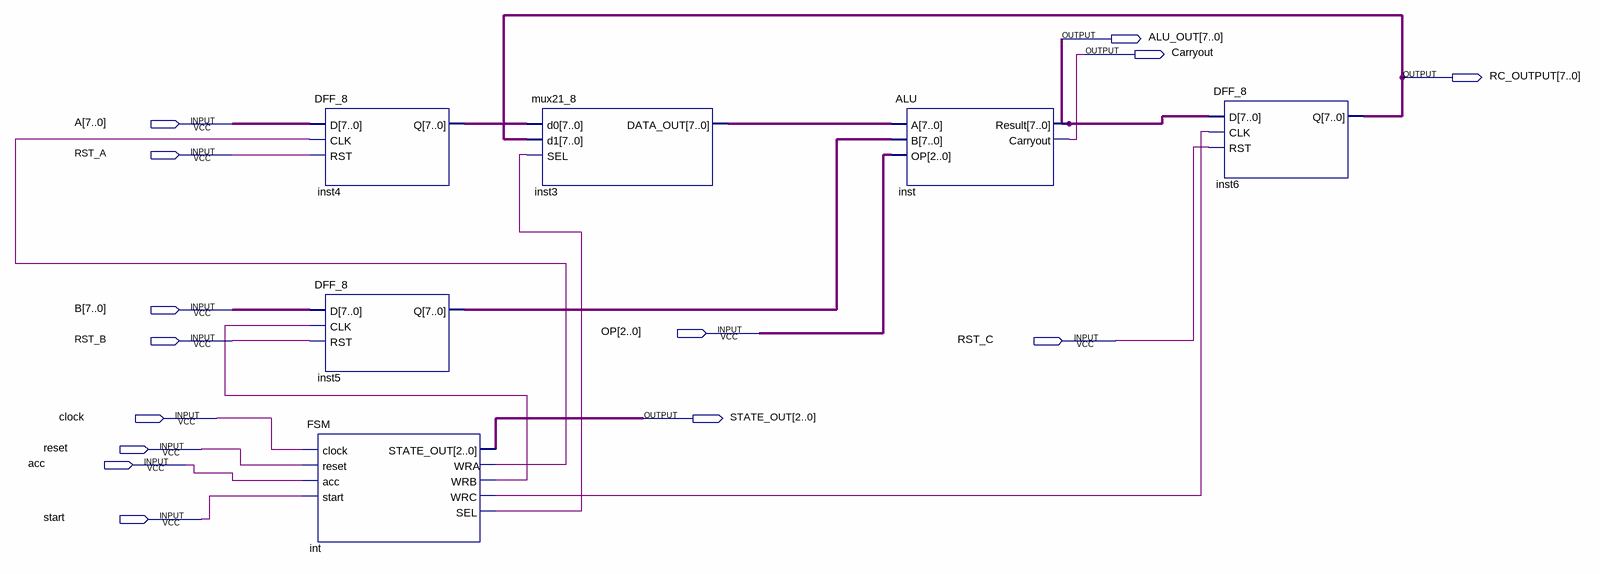
[diagram p0: schematic sheet]
// Quartus schematic Test1.bdf as structural Verilog: 6 symbols, 14 pins
module Test1 (
  input  [7:0] A,
  input  RST_A,
  input  [7:0] B,
  input  [2:0] OP,
  input  RST_B,
  input  RST_C,
  input  clock,
  input  reset,
  input  acc,
  input  start,
  output [7:0] ALU_OUT,
  output Carryout,
  output [7:0] RC_OUTPUT,
  output [2:0] STATE_OUT
);

  wire int_sel, int_wra, int_wrb, int_wrc;
  wire [7:0] inst3_data_out, inst4_q, inst5_q;

  DFF_8 inst4 (.D(A), .CLK(int_wra), .RST(RST_A), .Q(inst4_q));
  DFF_8 inst5 (.D(B), .CLK(int_wrb), .RST(RST_B), .Q(inst5_q));
  FSM \int  (
    .clock(clock), .reset(reset), .acc(acc), .start(start), .STATE_OUT(STATE_OUT), .WRA(int_wra),
    .WRB(int_wrb), .WRC(int_wrc), .SEL(int_sel));
  mux21_8 inst3 (.d0(inst4_q), .d1(RC_OUTPUT), .SEL(int_sel), .DATA_OUT(inst3_data_out));
  ALU inst (.A(inst3_data_out), .B(inst5_q), .OP(OP), .Result(ALU_OUT), .Carryout(Carryout));
  DFF_8 inst6 (.D(ALU_OUT), .CLK(int_wrc), .RST(RST_C), .Q(RC_OUTPUT));
endmodule
